# Altium schematic sheet UART.SchDoc
size A4
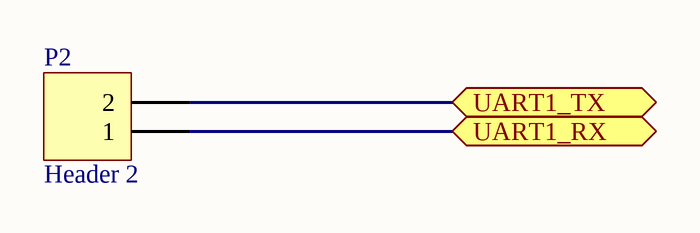
[diagram p0: UART.SchDoc]

## Parts
P2  Header 2  [HDR1X2]

## Ports
UART1_RX, UART1_TX

## Nets
UART1_RX: P2.1 ; port UART1_RX
UART1_TX: P2.2 ; port UART1_TX

## Library data of the parts
P2 = Header 2: Header, 2-Pin; LatestRevisionDate: 17-Jul-2002; LatestRevisionNote: Re-released for DXP Platform.; Publisher: Altium Limited